# EAGLE design Un_Battery (EAGLE 6.5.0)
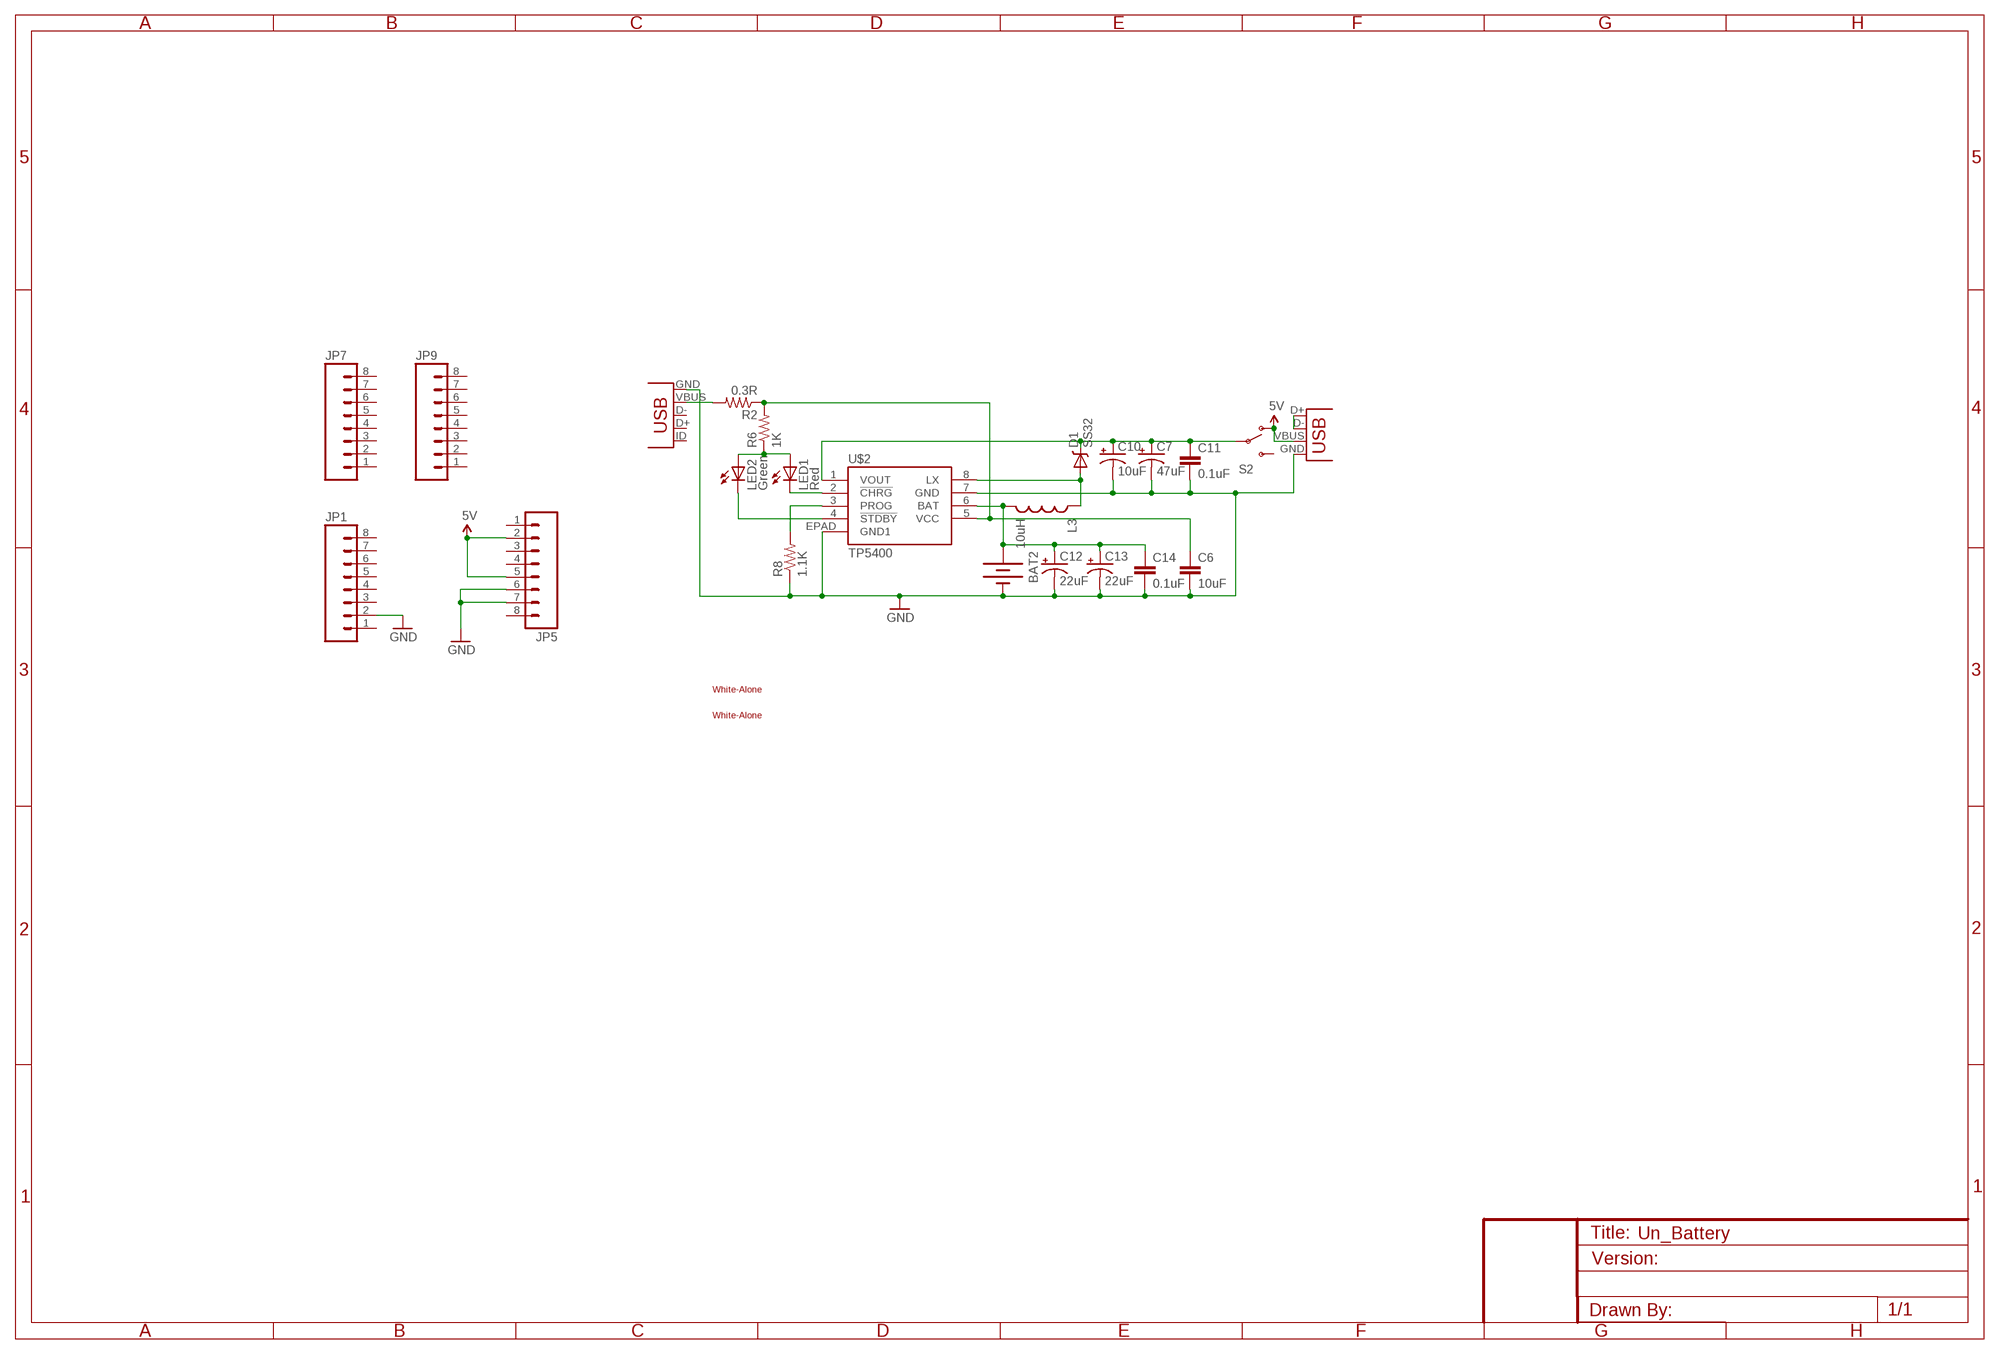
[diagram p0: schematic, sheet 1]

## Parts
BAT2  BATTERYLIPO  [BATTERY-LIPO]
C6  10uF  CAP1206  [1206]
C7  47uF  CAP_POLD  [PANASONIC_D]
C10  10uF  CAP_POL1206  [EIA3216]
C11  0.1uF  CAP1206  [1206]
C12  22uF  CAP_POL1206  [EIA3216]
C13  22uF  CAP_POL1206  [EIA3216]
C14  0.1uF  CAP1206  [1206]
D1  SS32  DIODE-SCHOTTKY_  [SMA-DIODE]
JP1  M081X08  [1X08]
JP5  M081X08  [1X08]
JP7  M081X08  [1X08]
JP9  M081X08  [1X08]
L3  10uH  INDUCTORCR75  [CR75]
LED1  Red  LED0805  [LED-0805]
LED2  Green  LED0805  [LED-0805]
R2  0.3R  RESISTOR1206  [1206]
R6  1K  RESISTOR0805-RES  [0805]
R8  1.1K  RESISTOR0805-RES  [0805]
S2  SWITCH-SPST  [SWITCH-SPDT2]
U$2  TP5400  [SO08-EPAD]
U$4  WHITE-ALONE_2  [WHITE-ALONE_2]
U$5  WHITE-ALONE_2  [WHITE-ALONE_2]
U$6  USB_5-SMD  [USB-MINIB]
X2  USB-A-S  [USB-A-S]

## Nets
5V: JP5.2 JP5.5 S2.1(O) X2.VBUS
GND: BAT2.- C6.2 C7.- C10.C(-) C11.2 C12.C(-) C13.C(-) C14.2 JP1.2 JP5.6 JP5.7 R8.1 U$2.7(GND) U$2.EPAD(GND1) U$6.GND X2.GND
N$1: R2.2 U$6.VBUS
N$2: C6.1 R2.1 R6.2 U$2.5(VCC)
N$3: LED1.1(A) LED2.1(A) R6.1
N$5: LED2.2(C) U$2.4(!STDBY)
N$6: LED1.2(C) U$2.2(!CHRG)
N$7: C7.+ C10.A(+) C11.1 D1.C S2.2(P) U$2.1(VOUT)
N$12: R8.2 U$2.3(PROG)
N$13: D1.A L3.P$1 U$2.8(LX)
N$16: X2.D+ X2.D-
N$19: BAT2.+ C12.A(+) C13.A(+) C14.1 L3.P$2 U$2.6(BAT)
N$28: JP5.1
N$30: JP5.3
N$31: JP5.4
Unconnected: JP1.1 JP1.3 JP1.4 JP1.5 JP1.6 JP1.7 JP1.8 JP5.8 JP7.1 JP7.2 JP7.3 JP7.4 JP7.5 JP7.6 JP7.7 JP7.8 JP9.1 JP9.2 JP9.3 JP9.4 JP9.5 JP9.6 JP9.7 JP9.8 S2.3(S) U$6.D+ U$6.D- U$6.ID(USBID)

## Library data of the parts
BAT2 = 2SparkFun:BATTERY: Battery Holders Various common sizes : AA, AAA, 20mm coin cell and 12mm coin cell.
C6 C11 C14 = 2SparkFun:CAP: Capacitor Standard 0603 ceramic capacitor, and 0.1" leaded capacitor.
C7 C10 C12 C13 = 2SparkFun:CAP_POL: Capacitor Polarized These are standard SMD and PTH capacitors. Normally 10uF, 47uF, and 100uF in electrolytic and tantalum varieties. Always verify the external diameter of the through hole cap, it varies with capacity, voltage, and manufacturer. The EIA devices should be standard.
D1 = 2SparkFun:DIODE-SCHOTTKY
JP1 JP5 JP7 JP9 = 2SparkFun:M08: Header 8 Standard 8-pin 0.1" header. Use with straight break away headers (SKU : PRT-00116), right angle break away headers (PRT-00553), swiss pins (PRT-00743), machine pins (PRT-00117), and female headers (PRT-00115).
L3 = 2SparkFun:INDUCTOR: Inductors Basic Inductor/Choke - 0603 and 1206. Footprints are not proven and vary greatly between part numbers.
LED1 LED2 = 2SparkFun:LED: LEDs Standard schematic elements and footprints for 5mm, 3mm, 1206, and 0603 sized LEDs. 5mm - Spark Fun Electronics SKU : COM-00529 (and others)
R2 R6 R8 = 2SparkFun:RESISTOR: Resistor Basic schematic elements and footprints for 0603, 1206, and PTH resistors.
S2 = 2SparkFun:SWITCH-SPST: SPST Switch Simple slide switch. Spark Fun Electronics SKU : COM-00102
U$2 = 2SparkFun:TP5400
U$4 U$5 = 2SparkFun:WHITE-ALONE
U$6 = 2SparkFun:USB_5
X2 = 2SparkFun:USB: USB Connectors USB-B-PTH is fully proven SKU : PRT-00139 USB-miniB is fully proven SKU : PRT-00587 USB-A-PCB is untested. USB-A-H is throughly reviewed, but untested. Spark Fun Electronics SKU : PRT-00437 USB-B-SMT is throughly reviewed, but untested. Needs silkscreen touching up. USB-A-S has not been used/tested USB-MB-H has not been used/tested

## Net classes
0 default: width 0.254 mm, clearance 0.254 mm
1 power: width 0.61 mm, drill 0.61 mm, clearance 0.254 mm
2 gnd: width 0.305 mm, drill 0.559 mm, clearance 0.254 mm
3 usbvcc: width 0.508 mm, drill 0.61 mm, clearance 0.254 mm
4 aref: width 0.406 mm, drill 0.61 mm, clearance 0.254 mm

## Board
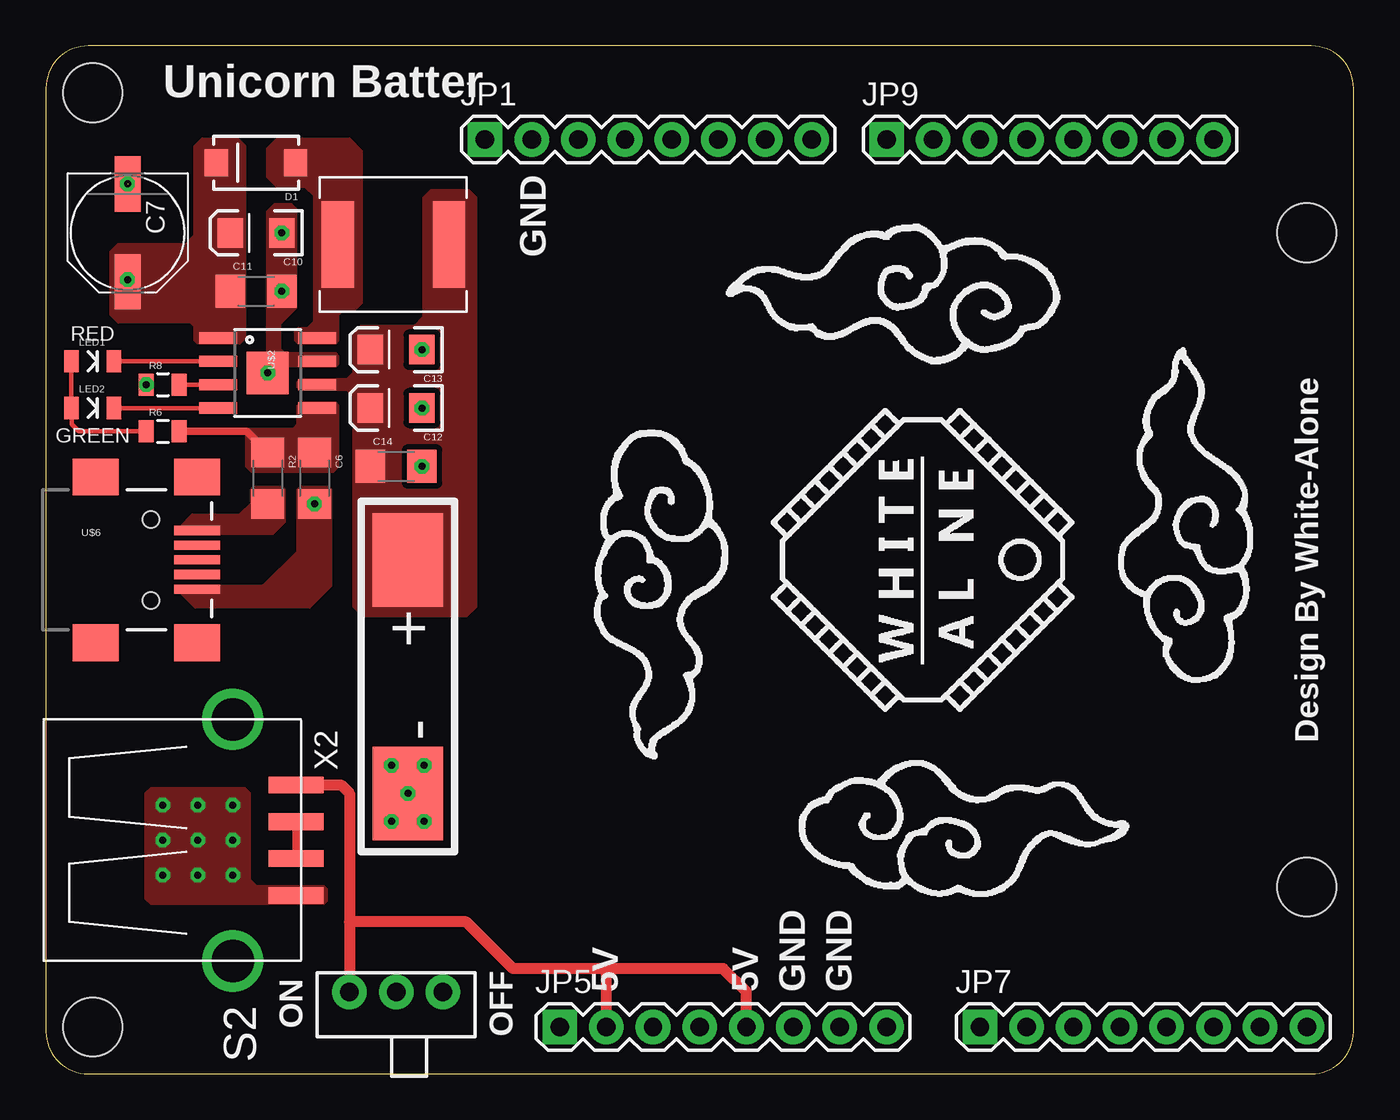
[diagram p1: board, top side]
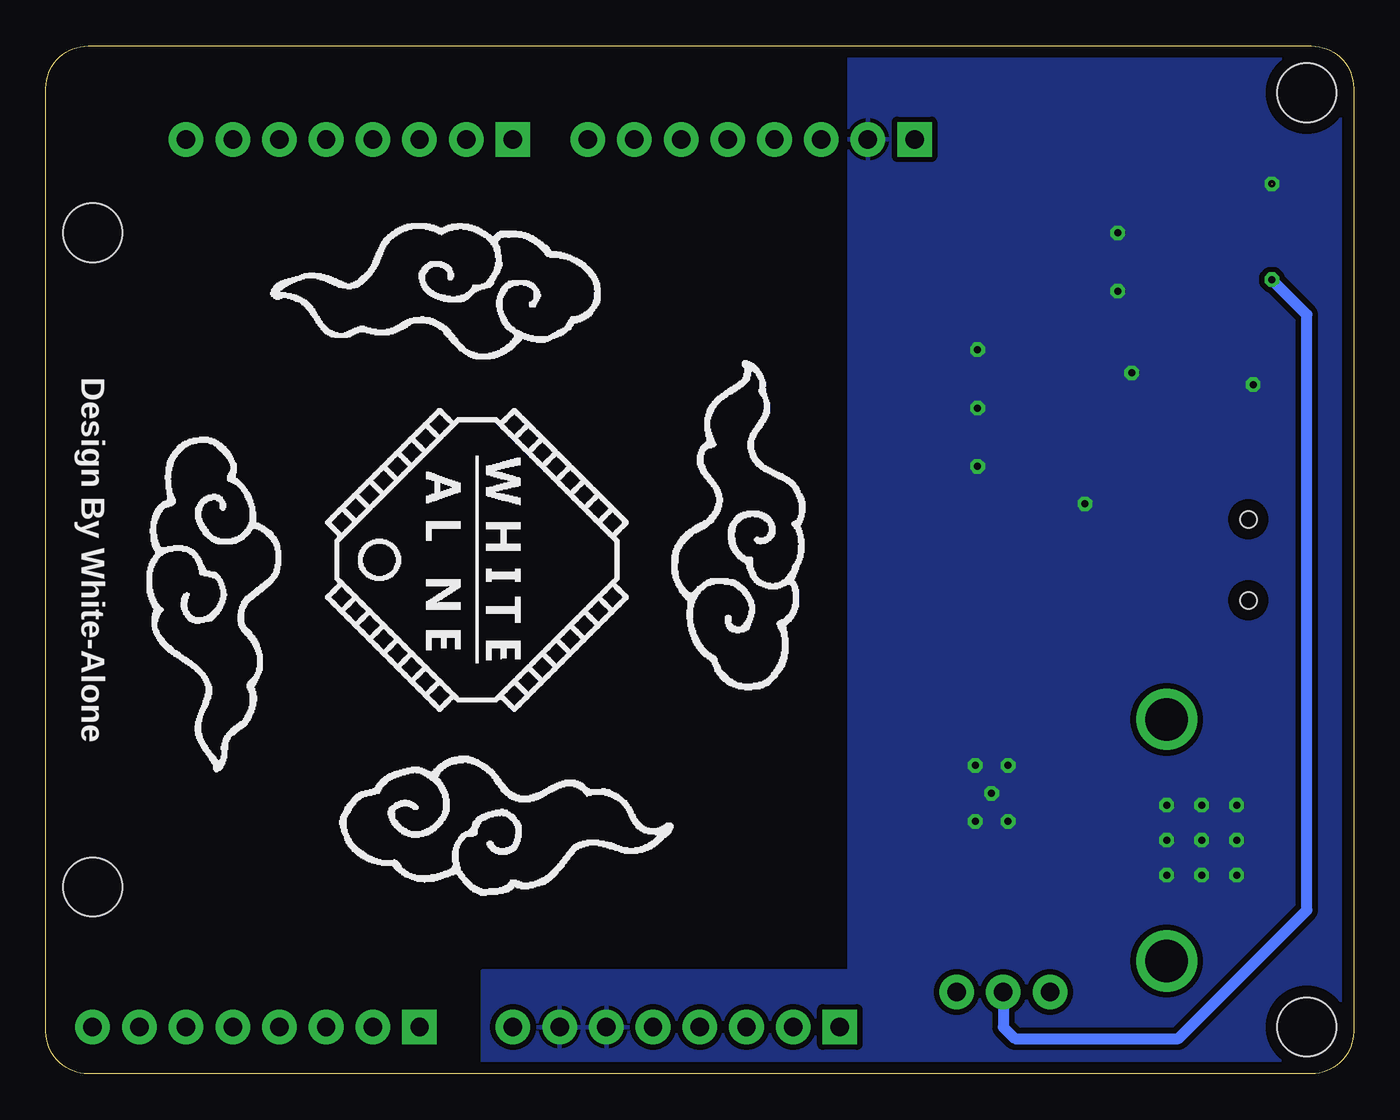
[diagram p2: board, bottom side, seen from below]

Size 71.12 x 55.88 mm. Coordinates in mm from the lower left corner, seen from the top.
Outline: 68.83,55.88 2.29,55.88 arc90 0,53.59 0,2.29 arc90 2.29,0 68.83,0 arc90 71.12,2.29 71.12,53.59 arc90 68.83,55.88
Copper layers (1*16): Top 0.035mm / dielectric 1.5mm / Bottom 0.035mm
Design rules "yun": minimum track width 8mil, minimum drill 15mil, track to track 8mil, track to pad 8mil, pad to pad 8mil, via to via 8mil, smd to smd 8mil, copper to edge 25mil, drill to drill 8mil, minimum pad ring 10mil, minimum via ring 8mil, stop-mask expansion 4mil, vias tented up to drill 20mil, thermal gap 8mil
Holes 3.2 mm at 2.54,2.54 68.58,45.72 68.58,10.16 2.54,53.34

### Footprints (pad centres in the part's own frame; a part is rotated, then mirrored left to right if it is on the bottom)
BATTERY-LIPO = smd 5.08 x 3.81: + -6.35,0; - 6.35,0
1206 = smd 1.6 x 1.8: 1 -1.4,0; 2 1.4,0
PANASONIC_D = smd 3 x 1.4: + 2.654,0; - -2.654,0
EIA3216 = smd 1.4 x 1.6: A 1.4,0; C -1.4,0
SMA-DIODE = smd 1.27 x 1.47: A -2.15,0; C 2.15,0
1X08 = drill 1 pad 1.88 square: 1 0,0 | drill 1 pad 1.88: 2 2.54,0; 3 5.08,0; 4 7.62,0; 5 10.16,0; 6 12.7,0; 7 15.24,0; 8 17.78,0
CR75 = smd 1.75 x 4.7: P$1 0,0; P$2 6.05,0
LED-0805 = smd 0.8 x 1.2: 1 -1.154,0; 2 1.154,0
0805 = smd 0.8 x 1.2: 1 -0.9,0; 2 0.9,0
SWITCH-SPDT2 = drill 1.016 pad 1.88: 1 0,2.54; 2 0,0; 3 0,-2.54
SO08-EPAD = smd 0.61 x 2.057: 1 -1.905,-2.692; 2 -0.635,-2.692; 3 0.635,-2.692; 4 1.905,-2.692; 5 1.905,2.692; 6 0.635,2.692; 7 -0.635,2.692; 8 -1.905,2.692 | smd 2.286 x 2.286: EPAD 0,0
USB-MINIB = smd 2.5 x 0.5: D+ 2.5,0; D- 2.5,0.8; GND 2.5,-1.6; ID 2.5,-0.8; VBUS 2.5,1.6 | smd 2.5 x 2: MTN1 -3,4.5; MTN2 2.5,4.5; MTN3 -3,-4.5; MTN4 2.5,-4.5 | hole 0.9: 0,2.2; 0,-2.2
USB-A-S = smd 3 x 0.9: D+ 3.45,-1; D- 3.45,1; GND 3.45,-3; VBUS 3.45,3 | drill 2.311: P$5 0,-6.566; P$6 0,6.566

### Placement (x,y rotation side)
BAT2  19.69,21.59 270 top
C6  14.61,32.38 270 top
C7  4.44,45.72 270 top
C10  11.43,45.72 180 top
C11  11.43,42.55 0 top
C12  19.05,36.2 180 top
C13  19.05,39.37 180 top
C14  19.05,33.02 0 top
D1  11.43,49.53 180 top
JP1  23.88,50.8 0 top
JP5  27.94,2.54 0 top
JP7  50.8,2.54 0 top
JP9  45.72,50.8 0 top
L3  15.88,45.09 0 top
LED1  2.54,38.73 0 top
LED2  2.54,36.2 0 top
R2  12.06,32.38 270 top
R6  6.35,34.92 0 top
R8  6.35,37.47 0 top
S2  19.05,4.45 90 top
U$2  12.06,38.1 270 top
U$4  47.62,27.94 270 bottom
U$5  47.62,27.94 90 top
U$6  5.72,27.94 0 top
X2  10.16,12.7 0 top

### Tracks (layer width: path | path; a pad name or v marks a point on that pad's centre or on a via)
5V
  Top 0.61: X2.VBUS 16.05,15.7 16.51,15.24 16.51,8.26 | 16.51,8.26 S2.1 | JP5.5 38.1,4.45 36.83,5.71 30.48,5.71 | JP5.2 30.48,5.71 | 30.48,5.71 25.4,5.71 22.86,8.26 16.51,8.26
GND  (via drill 0.38)  (1 unrouted)
  Top 0.406: R8.1 v5.46,37.47 | C13.C | C12.C | C14.2
  other vias: 18.8,16.76 18.8,13.72 20.57,13.72 19.69,15.24 20.57,16.76 20.45,39.37 20.45,36.2 12.06,38.1 20.45,33.02 12.83,45.72 12.83,42.55 4.44,48.39 14.61,30.99 10.16,12.7 8.25,12.7 8.25,14.61 10.16,14.61 8.25,10.79 10.16,10.79 6.35,10.79 6.35,12.7 6.35,14.61
  pour Bottom (isolate 0.305, rank 2): 0,55.88 27.43,55.88 27.43,5.59 47.37,5.59 47.37,0 0,0
  pour Top (isolate 0.305, no thermals): 13.08,38.48 12.06,37.08 13.08,37.08
  pour Top (isolate 0.305, no thermals): 5.72,9.27 15.11,9.27 15.24,9.4 15.24,10.03 15.11,10.16 11.43,10.16 11.05,10.54 11.05,15.24 10.8,15.49 5.72,15.49 5.46,15.24 5.46,9.53
  pour Top (isolate 0.305, no thermals): 12.45,47.24 13.33,47.24 13.59,46.99 13.59,41.66 12.7,40.77 12.7,39.4 12.95,39.14 15.75,39.14 15.88,39.01 15.88,38.61 15.75,38.48 12.32,38.48 12.06,38.73 12.06,46.86
  pour Top (isolate 0.305, no thermals): 7.37,26.49 11.81,26.49 13.72,28.37 13.72,31.75 13.84,31.88 15.37,31.88 15.49,31.75 15.49,26.54 14.35,25.4 8.13,25.4 7.37,26.16
N$1
  pour Top (isolate 0.305, no thermals): 7.32,29.39 12.32,29.39 12.95,30.02 12.95,31.75 12.83,31.88 11.3,31.88 11.18,31.75 11.18,30.99 10.54,30.35 7.95,30.35 7.32,29.72
N$2
  Top 0.406: R6.2 10.92,34.92 R2.1
  pour Top (isolate 0.305, no thermals): 11.18,32.77 15.62,32.77 15.88,33.02 15.88,36.32 15.75,36.45 13.84,36.45 13.72,36.32 13.72,35.31 13.46,35.05 11.05,35.05 10.92,34.92 10.92,33.02
N$3
  Top 0.254: R6.1 1.78,34.92 1.4,35.31 1.4,36.18 LED2.1 LED1.1
N$5
  Top 0.254: U$2.4 LED2.2
N$6
  Top 0.254: U$2.2 LED1.2
N$7  (via drill 0.38)
  Bottom 0.61: S2.2 19.05,2.54 18.42,1.91 9.53,1.91 2.54,8.89 2.54,41.27 v4.44,43.18
  pour Top (isolate 0.305, no thermals): 3.94,40.89 7.87,40.89 8.13,40.64 8.13,39.88 8.25,39.75 10.54,39.75 10.8,40.01 10.8,50.42 10.41,50.8 8.51,50.8 8.13,50.42 8.13,45.59 7.62,45.09 3.94,45.09 3.56,44.7 3.56,41.27
N$12
  Top 0.254: U$2.3 R8.2
N$13
  pour Top (isolate 0.305, no thermals): 13.72,39.75 15.75,39.75 15.88,39.88 15.88,41.27 16.13,41.53 16.76,41.53 17.14,41.91 17.14,50.16 16.51,50.8 12.57,50.8 12.06,50.29 12.06,48.77 12.57,48.26 14.1,48.26 14.61,47.75 14.61,40.89 14.22,40.51 13.72,40.51 13.59,40.39 13.59,39.88
N$16
  Top 0.406: X2.D- X2.D+
N$19
  pour Top (isolate 0.305, no thermals): 17.27,24.89 22.86,24.89 23.37,25.4 23.37,47.62 22.99,48.01 20.95,48.01 20.57,47.62 20.57,41.15 20.07,40.64 17.14,40.64 16.76,40.26 16.76,38.1 16.38,37.72 13.84,37.72 13.72,37.59 13.72,37.34 13.84,37.21 16.38,37.21 16.76,36.83 16.76,25.4

### Text on the board
tPlace: Unicorn Batter | GND | RED | GREEN | Design By White-Alone | ON | OFF | 5V | 5V | GND | GND
bPlace: Design By White-Alone